# EAGLE design RFM69_BOB (EAGLE 6.4)
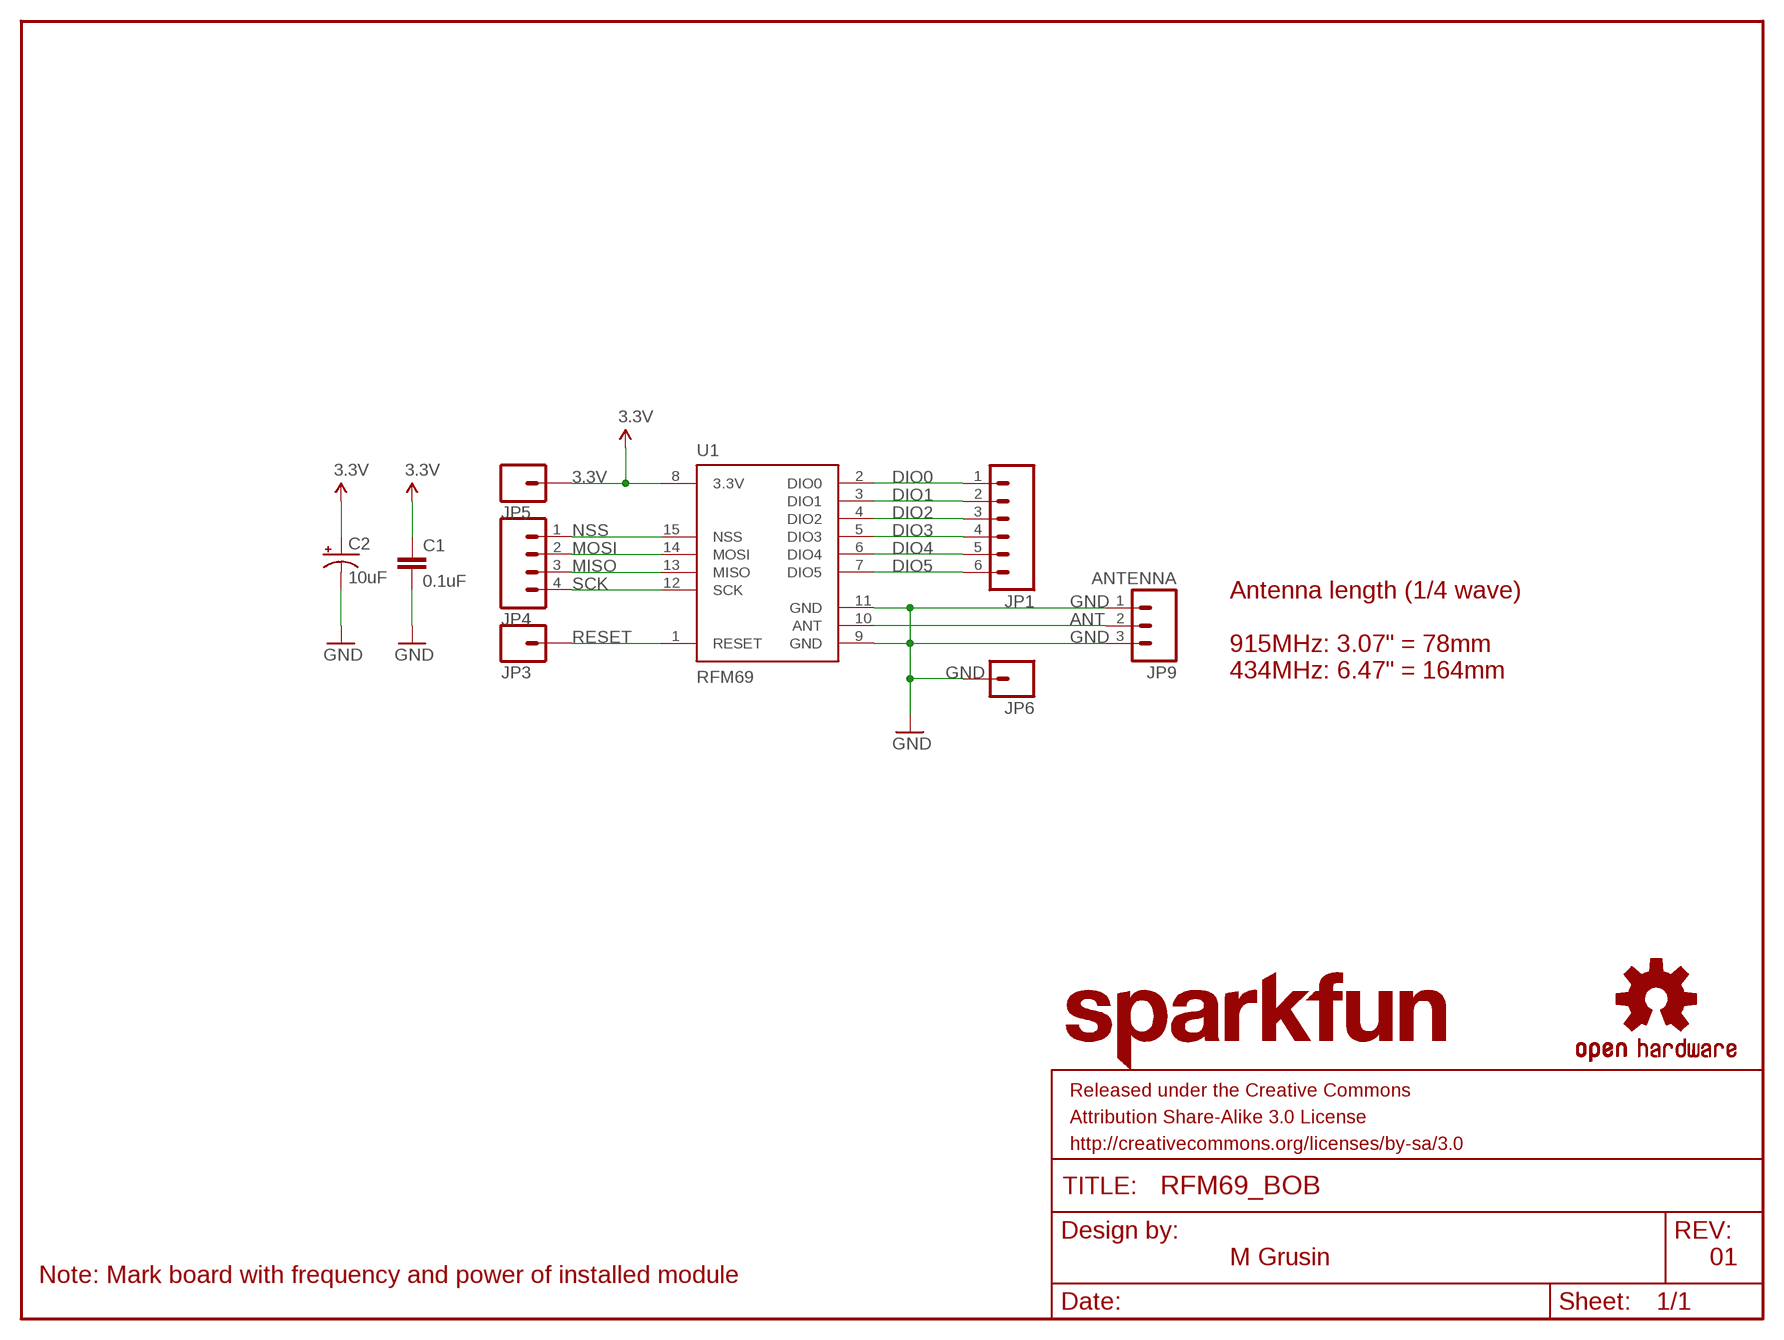
[diagram p0: schematic, sheet 1]

## Parts
C1  0.1uF  0.1UF-25V(+80/-20%)(0603)  [0603-CAP]
C2  10uF  10UF-16V-10%(TANT)  [EIA3216]
FRAME1  FRAME-LETTER  [CREATIVE_COMMONS]
JP1  M06_NOSILK_ROUND  [1X06_NO_SILK_ROUND]
JP3  M01SMDNS  [1X01NS]
JP4  M041X04_NO_SILK_ROUND  [1X04_NO_SILK_ROUND]
JP5  M01SMDNS  [1X01NS]
JP6  M01SMDNS  [1X01NS]
JP9  ANTENNA  M03_ROUND_ONLY_NO_SILK  [1X03_ROUND_ONLY_NO_SILK]
LOGO1  SFE_LOGO_NAME.1_INCH  [SFE_LOGO_NAME_.1]
LOGO2  OSHW-LOGOS  [OSHW-LOGO-S]
U1  RFM69  [RFM69]

## Nets
3.3V: C1.1 C2.A(+) JP5.1 U1.8(3.3V)
ANT: JP9.2 U1.10(ANT)
DIO0: JP1.1 U1.2(DIO0)
DIO1: JP1.2 U1.3(DIO1)
DIO2: JP1.3 U1.4(DIO2)
DIO3: JP1.4 U1.5(DIO3)
DIO4: JP1.5 U1.6(DIO4)
DIO5: JP1.6 U1.7(DIO5)
GND: C1.2 C2.C(-) JP6.1 JP9.1 JP9.3 U1.9(GND) U1.11(GND)
MISO: JP4.3 U1.13(MISO)
MOSI: JP4.2 U1.14(MOSI)
NSS: JP4.1 U1.15(NSS)
RESET: JP3.1 U1.1(RESET)
SCK: JP4.4 U1.12(SCK)

## Notes on the sheet
- Antenna length (1/4 wave)
  
  915MHz: 3.07" = 78mm
  434MHz: 6.47" = 164mm
- M Grusin | 01
- Note: Mark board with frequency and power of installed module

## Library data of the parts
C1 = SparkFun-Capacitors:0.1UF-25V(+80/-20%)(0603): CAP-00810 Ceramic Standard decoupling cap; PROD_ID: CAP-00810
C2 = SparkFun-Capacitors:10UF-16V-10%(TANT): CAP-00811 1206/EIA-3216 Tantalum capacitor; PROD_ID: CAP-00811
FRAME1 = SparkFun-Aesthetics:FRAME-LETTER: Schematic Frame Standard 8.5x11 US Letter frame
JP1 = mike-temp:M06: Header 6 Standard 6-pin 0.1" header. Use with straight break away headers (SKU : PRT-00116), right angle break away headers (PRT-00553), swiss pins (PRT-00743), machine pins (PRT-00117), and female headers (PRT-00115). Molex polarized connector foot print use with SKU : PRT-08094 with associated crimp pins and housings. NOTES ON THE VARIANTS LOCK and LOCK_LONGPADS... This footprint was designed to help hold the alignment of a through-hole component (i.e. 6-pin header) while soldering it into place. You may notice that each hole has been shifted either up or down by 0.005 of an inch from it's more standard position (which is a perfectly straight line). This slight alteration caused the pins (the squares in the middle) to touch the edges of the holes. Because they are alternating, it causes a "brace" to hold the component in place. 0.005 has proven to be the perfect amount of "off-center" position when using our standard breakaway headers. Although looks a little odd when you look at the bare footprint, once you have a header in there, the alteration is very hard to notice. Also, if you push a header all the way into place, it is covered up entirely on the bottom side. This idea of altering the position of holes to aid alignment will be further integrated into the Sparkfun Library for other footprints. It can help hold any component with 3 or more connection pins.
JP3 JP5 JP6 = mike-temp:M01: Header 1 Standard 1-pin 0.1" header. Use with straight break away headers (SKU : PRT-00116), right angle break away headers (PRT-00553), swiss pins (PRT-00743), machine pins (PRT-00117), and female headers (PRT-00115).
JP4 = mike-temp:M04: Header 4 Standard 4-pin 0.1" header. Use with straight break away headers (SKU : PRT-00116), right angle break away headers (PRT-00553), swiss pins (PRT-00743), machine pins (PRT-00117), and female headers (PRT-00115). Molex polarized connector foot print use with SKU : PRT-08231 with associated crimp pins and housings. 1MM SMD Version SKU: PRT-10208
JP9 = mike-temp:M03: Header 3 Standard 3-pin 0.1" header. Use with straight break away headers (SKU : PRT-00116), right angle break away headers (PRT-00553), swiss pins (PRT-00743), machine pins (PRT-00117), and female headers (PRT-00115). Molex polarized connector foot print use with SKU : PRT-08232 with associated crimp pins and housings.
LOGO1 = SparkFun-Aesthetics:SFE_LOGO_NAME: SFE Logo, name only This is the SparkFun name logo. The logo on the schematic will always be the same size; the package variant is the height of the flame part of the logo (or the height the flame would be, if it were drawn). Default layer for the logo on the board is tSilk.
LOGO2 = SparkFun-Aesthetics:OSHW-LOGO: Open Source Hardware Logo This logo indicates the piece of hardware it is found on incorporates a OSHW license and/or adheres to the definition of open source hardware found here: http://freedomdefined.org/OSHW
U1 = mike-temp:RFM69

## Board
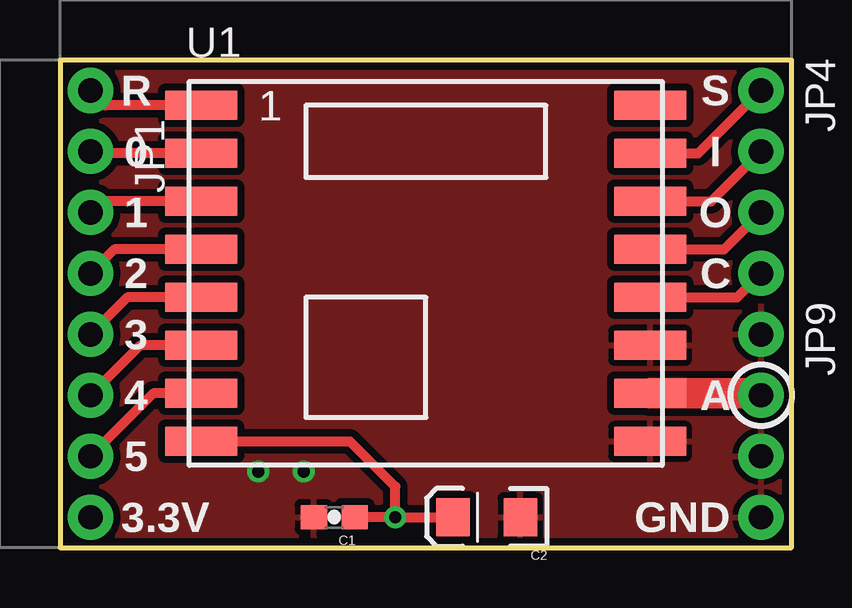
[diagram p1: board, top side]
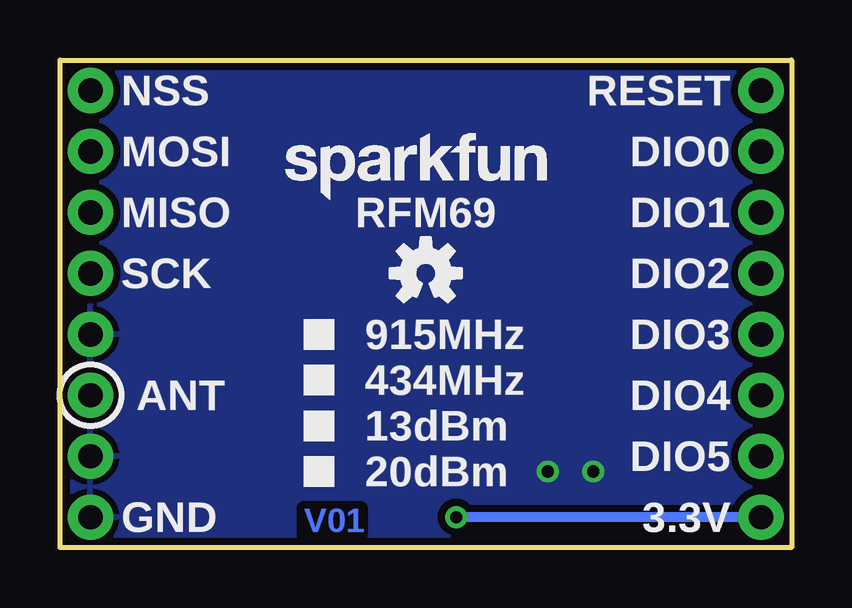
[diagram p2: board, bottom side, seen from below]

Size 30.48 x 20.32 mm. Coordinates in mm from the lower left corner, seen from the top.
Outline: 0,0 30.48,0 30.48,20.32 0,20.32 0,0
Copper layers (1*16): Top 0.035mm / dielectric 1.5mm / Bottom 0.035mm
Design rules "default *": minimum track width 10mil, minimum drill 24mil, track to track 8mil, track to pad 8mil, pad to pad 8mil, via to via 8mil, smd to smd 8mil, copper to edge 12mil, drill to drill 8mil, minimum pad ring 10mil, minimum via ring 8mil, stop-mask expansion 4mil, vias tented up to drill 0mil, thermal gap 10mil

### Footprints (pad centres in the part's own frame; a part is rotated, then mirrored left to right if it is on the bottom)
0603-CAP = smd 1.1 x 1: 1 -0.85,0; 2 0.85,0
EIA3216 = smd 1.4 x 1.6: A 1.4,0; C -1.4,0
1X06_NO_SILK_ROUND = drill 1.016 pad 1.88: 1 0,0; 2 2.54,0; 3 5.08,0; 4 7.62,0; 5 10.16,0; 6 12.7,0
1X01NS = drill 1.016 pad 1.88: 1 0,0
1X04_NO_SILK_ROUND = drill 1.016 pad 1.88: 1 0,0; 2 2.54,0; 3 5.08,0; 4 7.62,0
1X03_ROUND_ONLY_NO_SILK = drill 1.016 pad 1.88: 1 0,0; 2 2.54,0; 3 5.08,0
RFM69 = smd 3 x 1.2: 1 -9.35,7; 2 -9.35,5; 3 -9.35,3; 4 -9.35,1; 5 -9.35,-1; 6 -9.35,-3; 7 -9.35,-5; 8 -9.35,-7; 9 9.35,-7; 10 9.35,-5; 11 9.35,-3; 12 9.35,-1; 13 9.35,1; 14 9.35,3; 15 9.35,5; 16 9.35,7

### Placement (x,y rotation side)
C1  11.43,1.27 180 top
C2  17.78,1.27 180 top
FRAME1  -15.24,-12.7 0 top  (outside the outline)
JP1  1.27,16.51 270 top
JP3  1.27,19.05 0 top
JP4  29.21,19.05 270 top
JP5  1.27,1.27 0 top
JP6  29.21,1.27 0 top
JP9  29.21,8.89 270 top
LOGO1  21.59,13.97 0 bottom
LOGO2  15.24,11.43 0 bottom
U1  15.24,11.43 0 top

### Tracks (layer width: path | path; a pad name or v marks a point on that pad's centre or on a via)
3.3V  (via drill 0.51)
  Top 0.406: v13.97,1.27 C1.1 | v13.97,1.27 C2.A | U1.8 12.08,4.43 13.97,2.54 v13.97,1.27
  Bottom 0.406: JP5.1 v13.97,1.27
ANT
  Top 1.27: U1.10 29.13,6.43 JP9.2
DIO0
  Top 0.406: U1.2 1.35,16.43 JP1.1
DIO1
  Top 0.406: U1.3 1.73,14.43 JP1.2
DIO2
  Top 0.406: U1.4 2.27,12.43 JP1.3
DIO3
  Top 0.406: U1.5 2.81,10.43 JP1.4
DIO4
  Top 0.406: U1.6 3.35,8.43 JP1.5
DIO5
  Top 0.406: U1.7 3.89,6.43 JP1.6
GND  (via drill 0.51)
  other vias: 10.16,3.17 8.26,3.17
  pour Bottom (isolate 0.305): 0,20.32 30.48,20.32 30.48,0 0,0
  pour Top (isolate 0.305): 0,20.32 30.48,20.32 30.48,0 0,0
MISO
  Top 0.406: U1.13 27.67,12.43 JP4.3
MOSI
  Top 0.406: U1.14 27.13,14.43 JP4.2
NSS
  Top 0.406: U1.15 26.59,16.43 JP4.1
RESET
  Top 0.406: U1.1 1.89,18.43 JP3.1
SCK
  Top 0.406: U1.12 28.21,10.43 JP4.4

### Text on the board
Bottom: V01
tPlace: R | S | 0 | I | 1 | O | 2 | C | 3 | 4 | A | 5 | 3.3V | GND
bPlace: RESET | NSS | DIO0 | MOSI | DIO1 | RFM69 | MISO | DIO2 | SCK | DIO3 | 915MHz | DIO4 | 434MHz | ANT | 13dBm | DIO5 | 20dBm | 3.3V | GND
tDocu: M Grusin